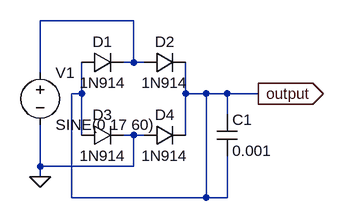
[diagram p0: schematic bridge_rectifier_with_cap_filter.asc]
bridge_rectifier_with_cap_filter.asc, the LTspice schematic file:
Version 4
SHEET 1 880 680
WIRE 208 32 64 32
WIRE 208 96 208 32
WIRE 208 96 192 96
WIRE 224 96 208 96
WIRE 64 112 64 32
WIRE 128 144 128 96
WIRE 128 144 112 144
WIRE 288 144 288 96
WIRE 320 144 288 144
WIRE 352 144 320 144
WIRE 400 144 352 144
WIRE 352 176 352 144
WIRE 128 208 128 144
WIRE 208 208 192 208
WIRE 224 208 208 208
WIRE 288 208 288 144
WIRE 64 256 64 192
WIRE 208 256 208 208
WIRE 208 256 64 256
WIRE 64 272 64 256
WIRE 112 304 112 144
WIRE 320 304 320 144
WIRE 320 304 112 304
WIRE 352 304 352 240
WIRE 352 304 320 304
FLAG 64 272 0
FLAG 400 144 output
IOPIN 400 144 Out
SYMBOL voltage 64 96 R0
WINDOW 123 0 0 Left 0
WINDOW 39 0 0 Left 0
SYMATTR InstName V1
SYMATTR Value SINE(0 17 60)
SYMBOL diode 128 80 M90
WINDOW 0 0 32 VBottom 2
WINDOW 3 32 32 VTop 2
SYMATTR InstName D1
SYMATTR Value 1N914
SYMBOL diode 224 80 M90
WINDOW 0 0 32 VBottom 2
WINDOW 3 32 32 VTop 2
SYMATTR InstName D2
SYMATTR Value 1N914
SYMBOL diode 128 224 R270
WINDOW 0 32 32 VTop 2
WINDOW 3 0 32 VBottom 2
SYMATTR InstName D3
SYMATTR Value 1N914
SYMBOL diode 224 224 R270
WINDOW 0 32 32 VTop 2
WINDOW 3 0 32 VBottom 2
SYMATTR InstName D4
SYMATTR Value 1N914
SYMBOL cap 336 176 R0
SYMATTR InstName C1
SYMATTR Value 0.001

The netlist it stands for:
* bridge_rectifier_with_cap_filter.asc
V1 N001 0 SINE(0 17 60)
D1 output N001 1N914
D2 N001 output 1N914
D3 output 0 1N914
D4 0 output 1N914
C1 output output 0.001
.model D D
.lib standard.dio
.backanno
.end